# Altium schematic sheet stand.SchDoc
size A0; SheetNumber: 1; SheetTotal: 1
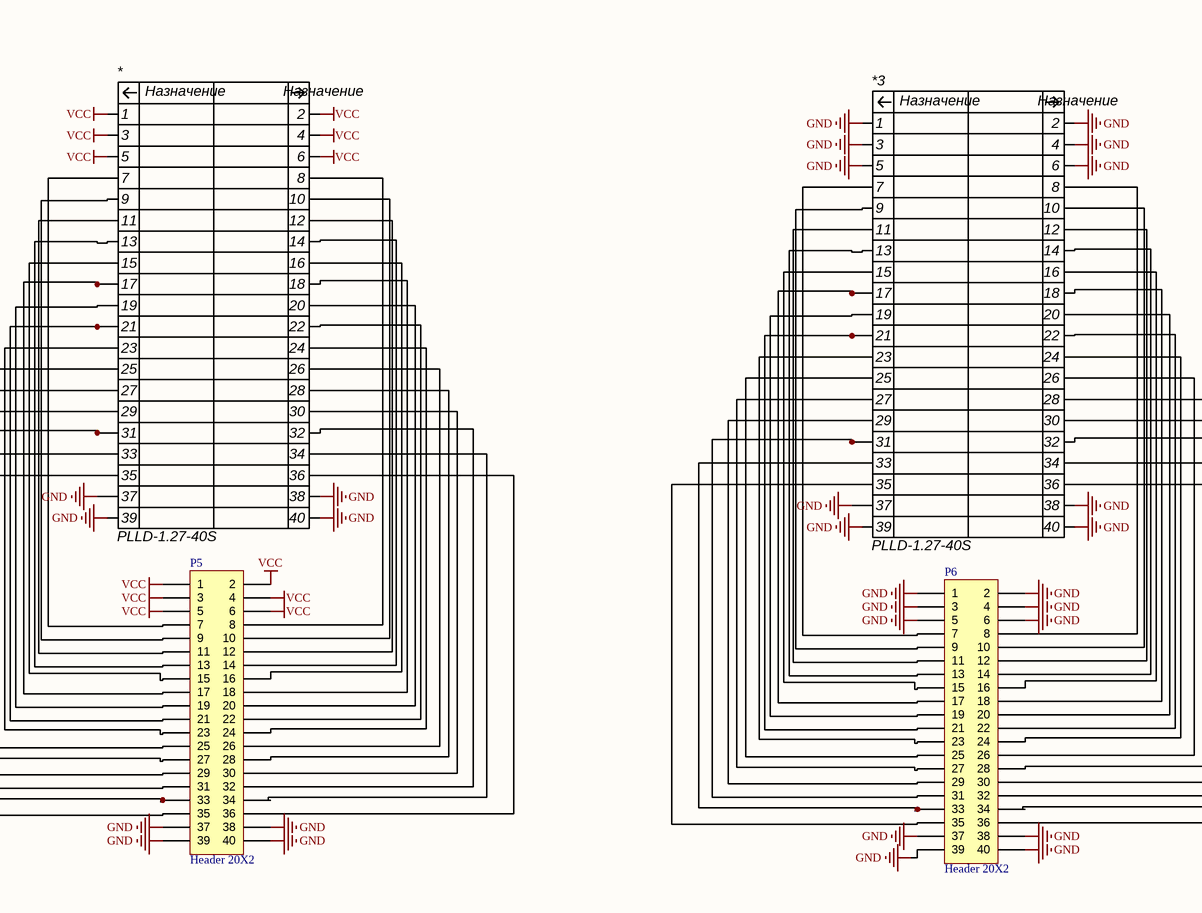
[diagram p0: stand.SchDoc, left]
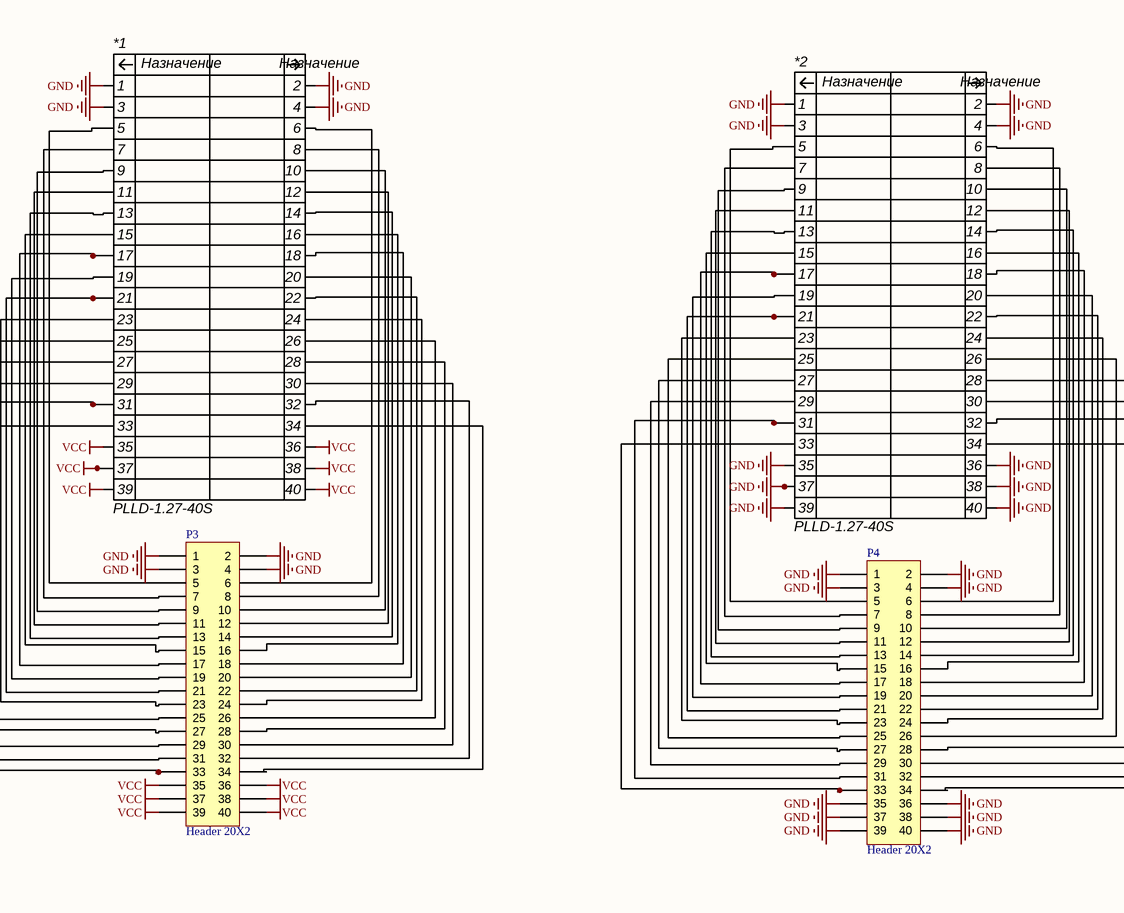
[diagram p1: stand.SchDoc, right]

## Parts
*  PLLD-1.27-40S  [Headr 2x20 male]
*1  PLLD-1.27-40S  [Headr 2x20 male]
*2  PLLD-1.27-40S  [Headr 2x20 male]
*3  PLLD-1.27-40S  [Headr 2x20 male]
P3  Header 20X2  [HDR2X20]
P4  Header 20X2  [HDR2X20]
P5  Header 20X2  [HDR2X20]
P6  Header 20X2  [HDR2X20]

## Nets
GND: *.37 *.38 *.39 *.40 *1.1 *1.2 *1.3 *1.4 *2.1 *2.2 *2.3 *2.4 *2.35 *2.36 *2.37 *2.38 *2.39 *2.40 *3.1 *3.2 *3.3 *3.4 *3.5 *3.6 *3.37 *3.38 *3.39 *3.40 P3.1 P3.2 P3.3 P3.4 P4.1 P4.2 P4.3 P4.4 P4.35 P4.36 P4.37 P4.38 P4.39 P4.40 P5.37 P5.38 P5.39 P5.40 P6.1 P6.2 P6.3 P6.4 P6.5 P6.6 P6.37 P6.38 P6.39 P6.40
VCC: *.1 *.2 *.3 *.4 *.5 *.6 *1.35 *1.36 *1.37 *1.38 *1.39 *1.40 P3.35 P3.36 P3.37 P3.38 P3.39 P3.40 P5.1 P5.2 P5.3 P5.4 P5.5 P5.6
Net*1_5: *1.5 P3.5
Net*1_6: *1.6 P3.6
Net*1_7: *1.7 P3.7
Net*1_8: *1.8 P3.8
Net*1_9: *1.9 P3.9
Net*1_10: *1.10 P3.10
Net*1_11: *1.11 P3.11
Net*1_12: *1.12 P3.12
Net*1_13: *1.13 P3.13
Net*1_14: *1.14 P3.14
Net*1_15: *1.15 P3.15
Net*1_16: *1.16 P3.16
Net*1_17: *1.17 P3.17
Net*1_18: *1.18 P3.18
Net*1_19: *1.19 P3.19
Net*1_20: *1.20 P3.20
Net*1_21: *1.21 P3.21
Net*1_22: *1.22 P3.22
Net*1_23: *1.23 P3.23
Net*1_24: *1.24 P3.24
Net*1_25: *1.25 P3.25
Net*1_26: *1.26 P3.26
Net*1_27: *1.27 P3.27
Net*1_28: *1.28 P3.28
Net*1_29: *1.29 P3.29
Net*1_30: *1.30 P3.30
Net*1_31: *1.31 P3.31
Net*1_32: *1.32 P3.32
Net*1_33: *1.33 P3.33
Net*1_34: *1.34 P3.34
Net*2_5: *2.5 P4.5
Net*2_6: *2.6 P4.6
Net*2_7: *2.7 P4.7
Net*2_8: *2.8 P4.8
Net*2_9: *2.9 P4.9
Net*2_10: *2.10 P4.10
Net*2_11: *2.11 P4.11
Net*2_12: *2.12 P4.12
Net*2_13: *2.13 P4.13
Net*2_14: *2.14 P4.14
Net*2_15: *2.15 P4.15
Net*2_16: *2.16 P4.16
Net*2_17: *2.17 P4.17
Net*2_18: *2.18 P4.18
Net*2_19: *2.19 P4.19
Net*2_20: *2.20 P4.20
Net*2_21: *2.21 P4.21
Net*2_22: *2.22 P4.22
Net*2_23: *2.23 P4.23
Net*2_24: *2.24 P4.24
Net*2_25: *2.25 P4.25
Net*2_26: *2.26 P4.26
Net*2_27: *2.27 P4.27
Net*2_28: *2.28 P4.28
Net*2_29: *2.29 P4.29
Net*2_30: *2.30 P4.30
Net*2_31: *2.31 P4.31
Net*2_32: *2.32 P4.32
Net*2_33: *2.33 P4.33
Net*2_34: *2.34 P4.34
Net*3_7: *3.7 P6.7
Net*3_8: *3.8 P6.8
Net*3_9: *3.9 P6.9
Net*3_10: *3.10 P6.10
Net*3_11: *3.11 P6.11
Net*3_12: *3.12 P6.12
Net*3_13: *3.13 P6.13
Net*3_14: *3.14 P6.14
Net*3_15: *3.15 P6.15
Net*3_16: *3.16 P6.16
Net*3_17: *3.17 P6.17
Net*3_18: *3.18 P6.18
Net*3_19: *3.19 P6.19
Net*3_20: *3.20 P6.20
Net*3_21: *3.21 P6.21
Net*3_22: *3.22 P6.22
Net*3_23: *3.23 P6.23
Net*3_24: *3.24 P6.24
Net*3_25: *3.25 P6.25
Net*3_26: *3.26 P6.26
Net*3_27: *3.27 P6.27
Net*3_28: *3.28 P6.28
Net*3_29: *3.29 P6.29
Net*3_30: *3.30 P6.30
Net*3_31: *3.31 P6.31
Net*3_32: *3.32 P6.32
Net*3_33: *3.33 P6.33
Net*3_34: *3.34 P6.34
Net*3_35: *3.35 P6.35
Net*3_36: *3.36 P6.36
Net*_7: *.7 P5.7
Net*_8: *.8 P5.8
Net*_9: *.9 P5.9
Net*_10: *.10 P5.10
Net*_11: *.11 P5.11
Net*_12: *.12 P5.12
Net*_13: *.13 P5.13
Net*_14: *.14 P5.14
Net*_15: *.15 P5.15
Net*_16: *.16 P5.16
Net*_17: *.17 P5.17
Net*_18: *.18 P5.18
Net*_19: *.19 P5.19
Net*_20: *.20 P5.20
Net*_21: *.21 P5.21
Net*_22: *.22 P5.22
Net*_23: *.23 P5.23
Net*_24: *.24 P5.24
Net*_25: *.25 P5.25
Net*_26: *.26 P5.26
Net*_27: *.27 P5.27
Net*_28: *.28 P5.28
Net*_29: *.29 P5.29
Net*_30: *.30 P5.30
Net*_31: *.31 P5.31
Net*_32: *.32 P5.32
Net*_33: *.33 P5.33
Net*_34: *.34 P5.34
Net*_35: *.35 P5.35
Net*_36: *.36 P5.36

## Notes on the sheet
- DWG. NO.
- REV.
- SHT.
- THIS DOCUMENT AND THE DATA DISCLOSED HEREIN OR HEREWITH IS THE PROPERTY OF ALTIUM LIMITED AND MAY BE FREELY DISTRIBUTED IN WHOLE. NO RIGHTS ARE RESERVED OR EXPRESS OR IMPLIED WARANTEE GIVEN.
- REVISION
- DESCRIPTION
- DATE
- APPROVED
- ENG:
- APPROVALS
- PROJECT
- DSN:
- CHK:
- REFERENCE DOCUMENTS
- PROJECT REVISION:
- TITLE
- DOCUMENT REVISION:
- DESIGN ITEM:
- BOM:
- FAB DWG:
- PCB DWG:
- ASSY DWG:
- SCALE:
- SIZE
- B
- CAGE CODE
- FILE NAME
- DWG NO.
- SHEET
- OF
- REV
- (in symbol PLLD-1.27-40S) Назначение

## Library data of the parts
P3-P6 = Header 20X2: Header, 20-Pin, Dual row; LatestRevisionDate: 17-Jul-2002; LatestRevisionNote: Re-released for DXP Platform.; Publisher: Altium Limited